# Altium schematic sheet UI.SchDoc
size A4; SheetNumber: 1; SheetTotal: 1
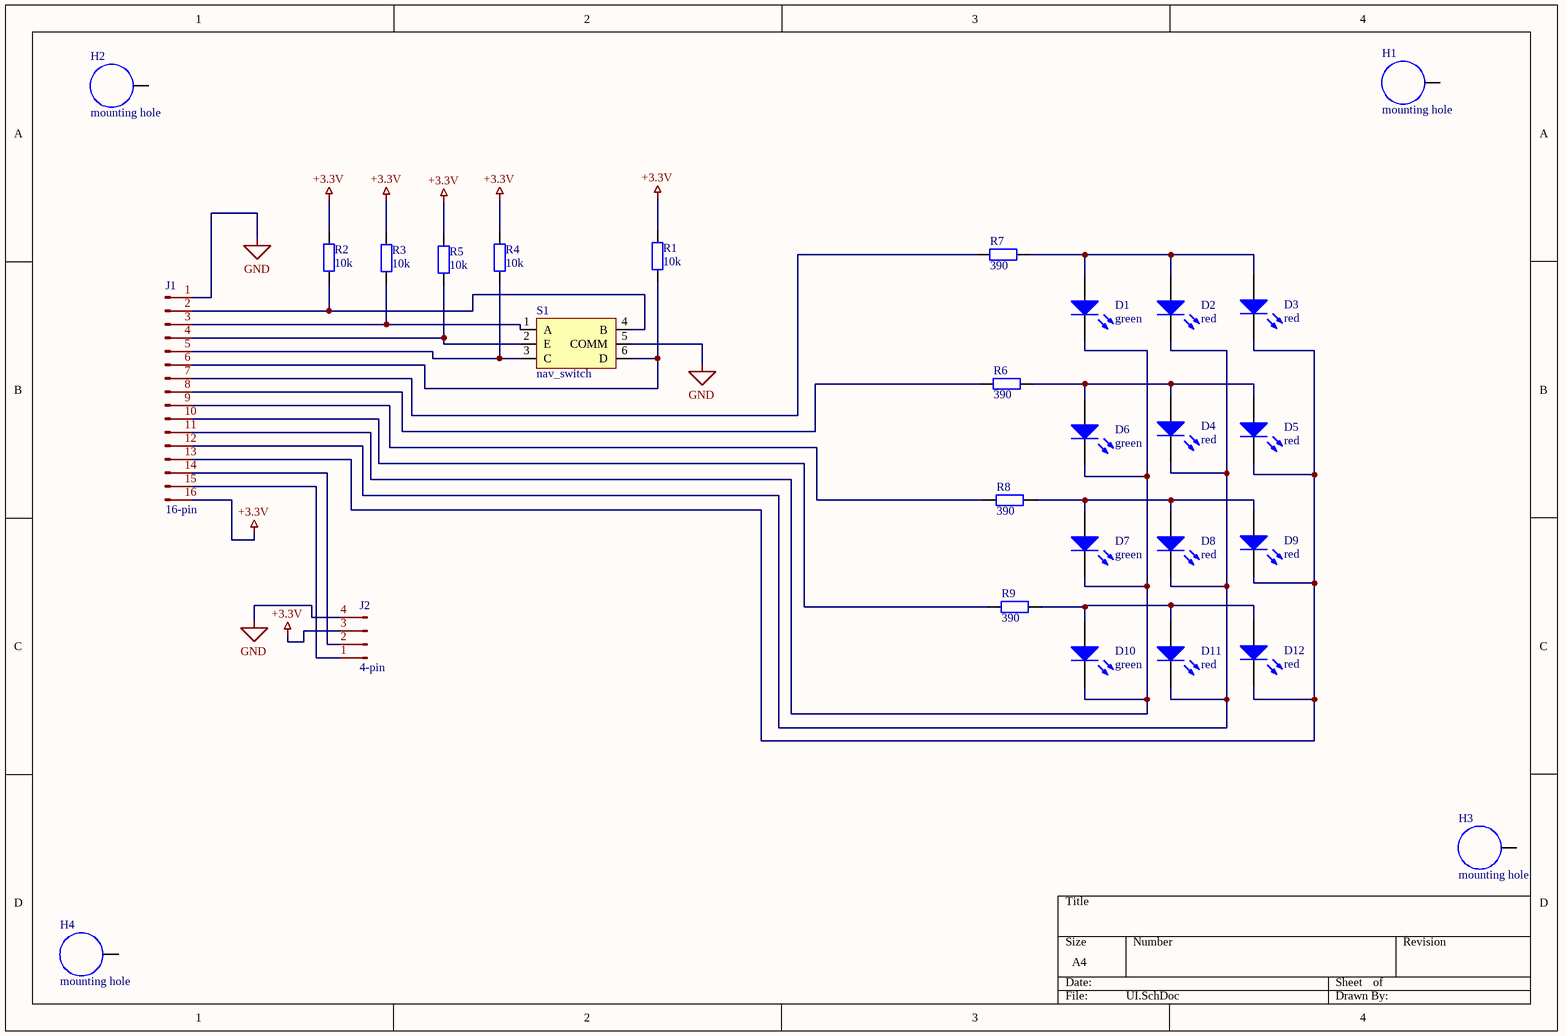
[diagram p0: UI.SchDoc]

## Parts
D1  green  [0805 LED]
D2  red  [0805 LED]
D3  red  [0805 LED]
D4  red  [0805 LED]
D5  red  [0805 LED]
D6  green  [0805 LED]
D7  green  [0805 LED]
D8  red  [0805 LED]
D9  red  [0805 LED]
D10  green  [0805 LED]
D11  red  [0805 LED]
D12  red  [0805 LED]
H1  mounting hole  [M3 HOLE iso]
H2  mounting hole  [M3 HOLE iso]
H3  mounting hole  [M3 HOLE iso]
H4  mounting hole  [M3 HOLE iso]
J1  16-pin  [JST_XH_B16B-XH-A_1x16_P2.50mm_Vertical]
J2  4-pin  [JST_SH_SM04B-SRSS-TB_1x04-1MP_P1.00mm_Horizontal]
R1  10k  [0805]
R2  10k  [0805]
R3  10k  [0805]
R4  10k  [0805]
R5  10k  [0805]
R6  390  [0805]
R7  390  [0805]
R8  390  [0805]
R9  390  [0805]
S1  nav_switch  [NAV_SWITCH_SJ1400BFQ]

## Nets
+3.3V: J1.16(Pin_16) J2.3(Pin_3) R1.1 R2.1 R3.1 R4.1 R5.1
GND: J1.1(Pin_1) J2.4(Pin_4) S1.5(COMM)
NetD1_1: D1.1(K) D6.1(K) D7.1(K) D10.1(K) J1.11(Pin_11)
NetD1_2: D1.2(A) D2.2(A) D3.2(A) R7.2
NetD2_1: D2.1(K) D4.1(K) D8.1(K) D11.1(K) J1.12(Pin_12)
NetD3_1: D3.1(K) D5.1(K) D9.1(K) D12.1(K) J1.13(Pin_13)
NetD4_2: D4.2(A) D5.2(A) D6.2(A) R6.2
NetD7_2: D7.2(A) D8.2(A) D9.2(A) R8.2
NetD10_2: D10.2(A) D11.2(A) D12.2(A) R9.2
NetJ1_2: J1.2(Pin_2) R2.2 S1.4(B)
NetJ1_3: J1.3(Pin_3) R3.2 S1.1(A)
NetJ1_4: J1.4(Pin_4) R5.2 S1.2(E)
NetJ1_5: J1.5(Pin_5) R4.2 S1.3(C)
NetJ1_6: J1.6(Pin_6) R1.2 S1.6(D)
NetJ1_7: J1.7(Pin_7) R7.1
NetJ1_8: J1.8(Pin_8) R6.1
NetJ1_9: J1.9(Pin_9) R8.1
NetJ1_10: J1.10(Pin_10) R9.1
NetJ1_14: J1.14(Pin_14) J2.2(Pin_2)
NetJ1_15: J1.15(Pin_15) J2.1(Pin_1)

Not connected (* = marked no-connect by the designer): H1 1; H2 1; H3 1; H4 1

## Library data of the parts
D1-D12 = LED
R1-R9 = res0805